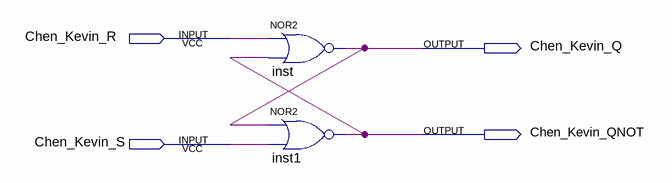
[diagram p0: schematic sheet]
// Quartus schematic Chen_Kevin_SR-Latch.bdf as structural Verilog: 2 symbols, 4 pins
module \Chen_Kevin_SR-Latch  (
  input  Chen_Kevin_R,
  input  Chen_Kevin_S,
  output Chen_Kevin_Q,
  output Chen_Kevin_QNOT
);

  nor inst (Chen_Kevin_Q, Chen_Kevin_R, Chen_Kevin_QNOT);
  nor inst1 (Chen_Kevin_QNOT, Chen_Kevin_Q, Chen_Kevin_S);
endmodule
